# Altium schematic sheet S7CAS-PLEIADES-CARTE-MERE_P07_TITLE.SchDoc
size Tabloid; DocumentNumber: 1; SheetNumber: 1; SheetTotal: 16; Sheet_Name: Title; Size: 11x17
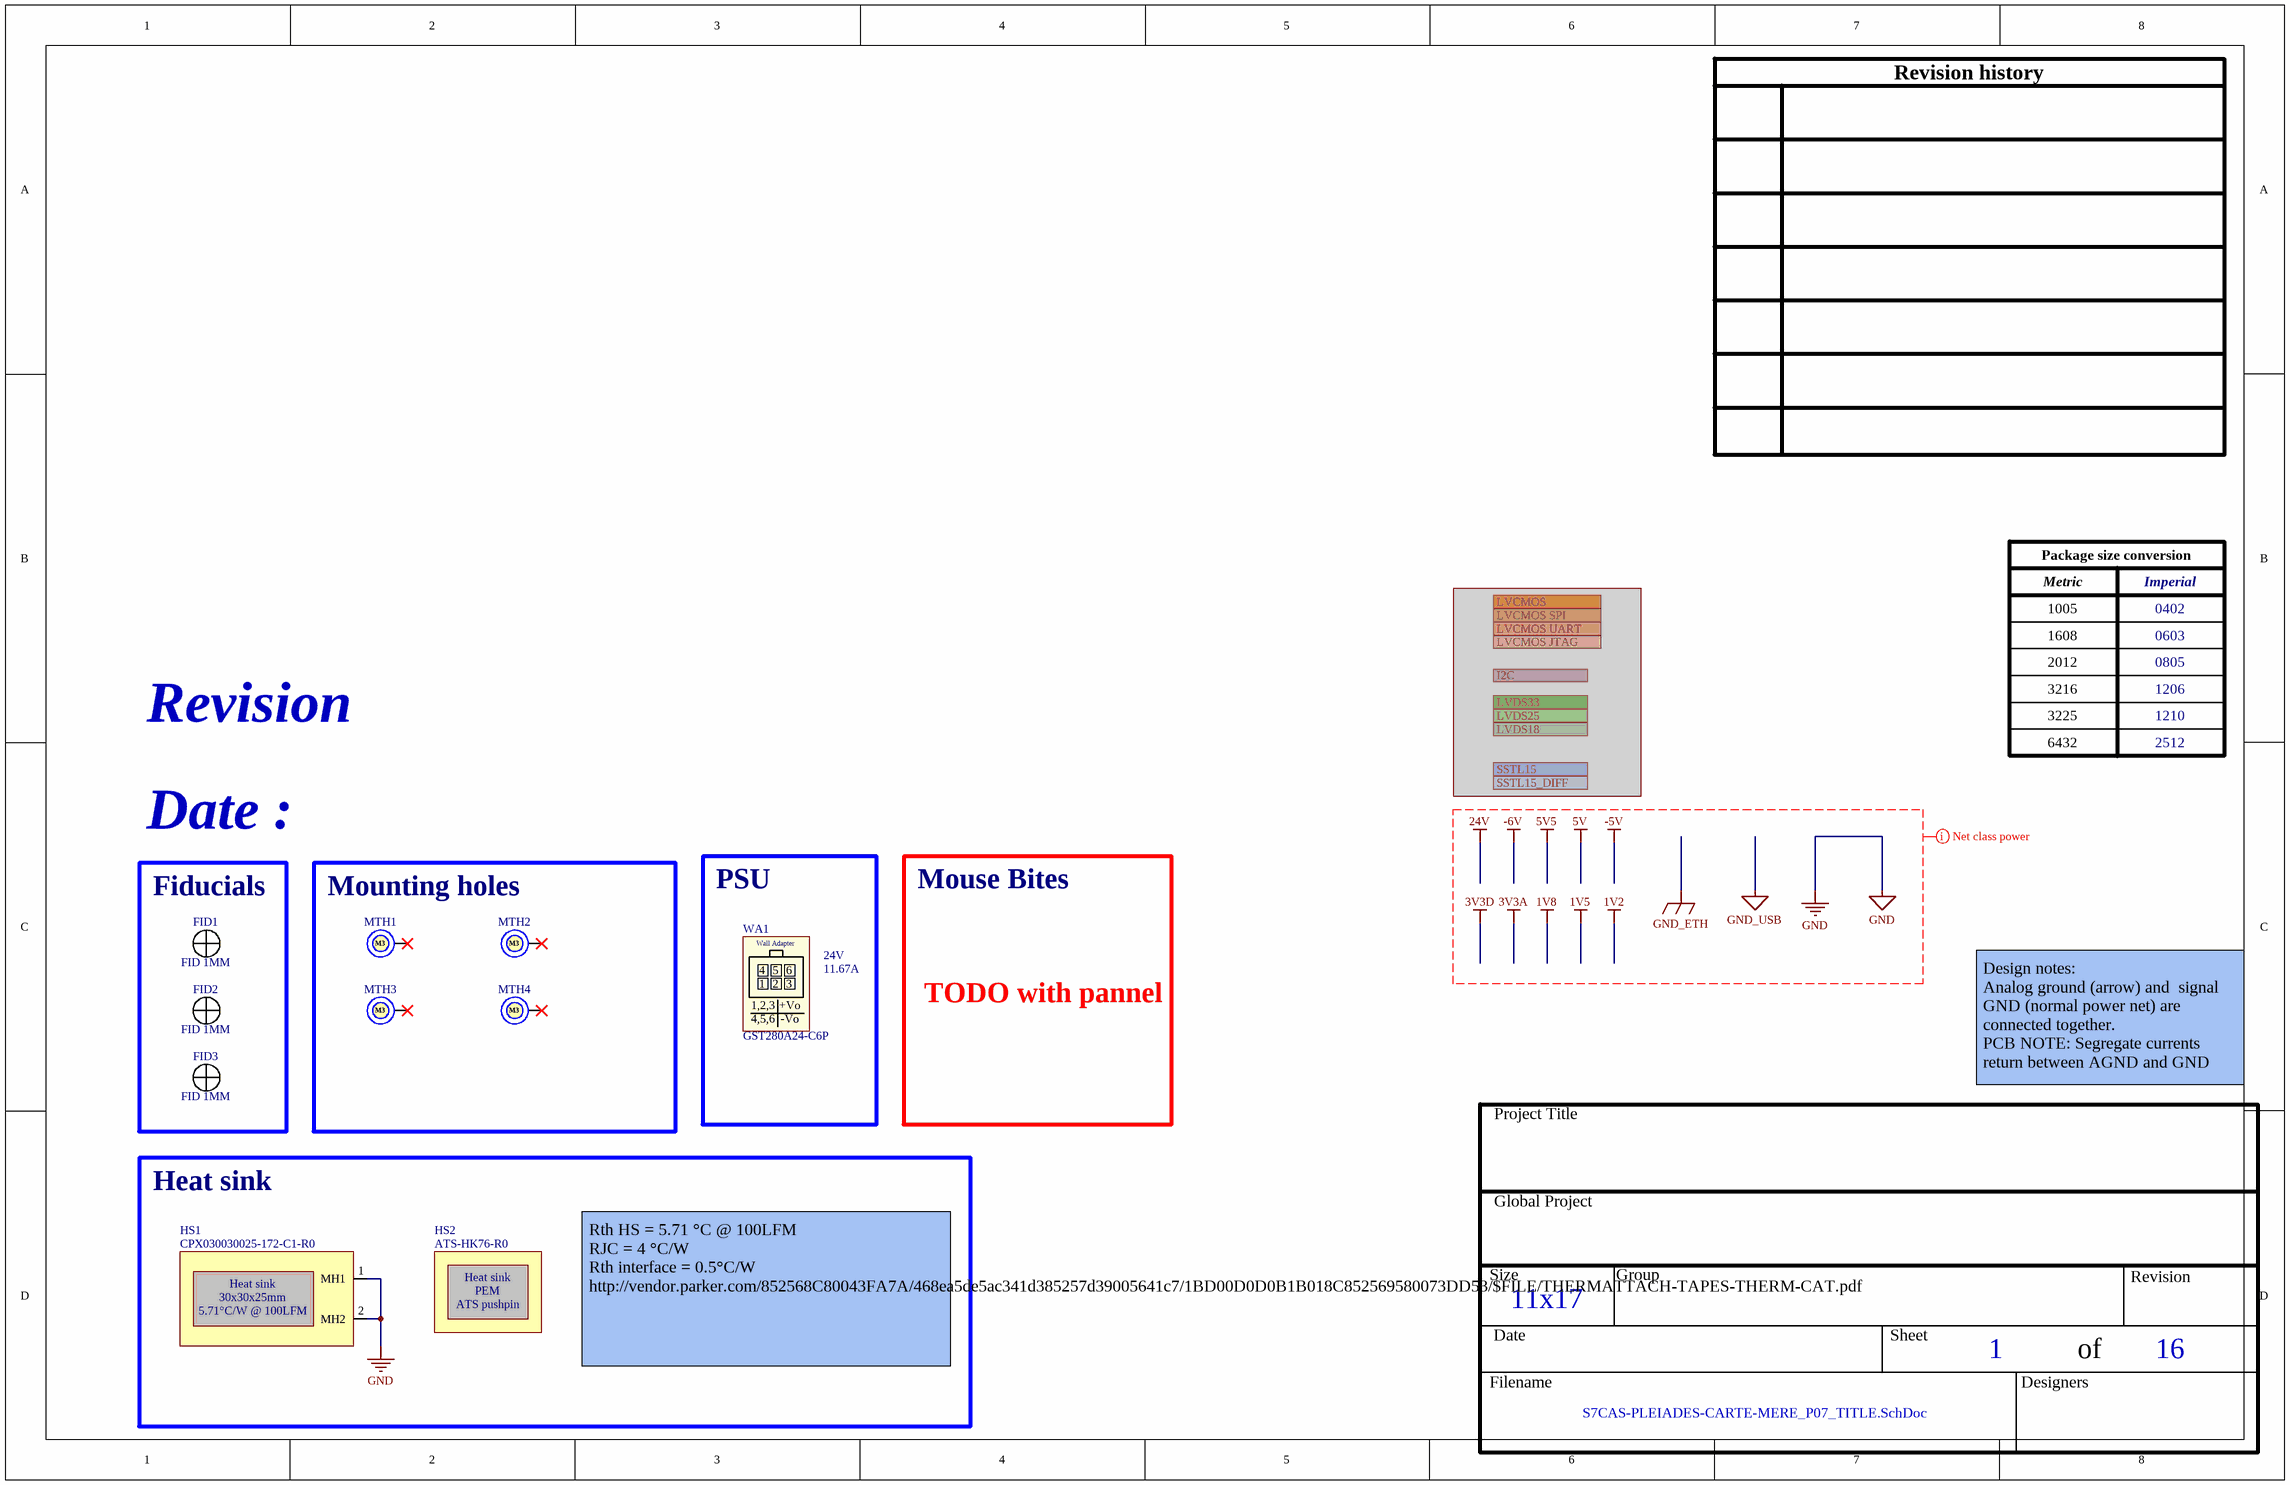
[diagram p0: S7CAS-PLEIADES-CARTE-MERE_P07_TITLE.SchDoc]

## Parts
FID1  FID 1MM  [FID_CIRCLE_1MM]
FID2  FID 1MM  [FID_CIRCLE_1MM]
FID3  FID 1MM  [FID_CIRCLE_1MM]
HS1  CPX030030025-172-C1-R0  [THE_HS_ATS-CPX030030025-172-C1-R0]
HS2  ATS-HK76-R0  [THE_HS_ATS-CPX030030025-172-C1-R0]  (mechanical)
MTH1  M3  [MTH_M3]  (no BOM)
MTH2  M3  [MTH_M3]  (no BOM)
MTH3  M3  [MTH_M3]  (no BOM)
MTH4  M3  [MTH_M3]  (no BOM)
WA1  GST280A24-C6P  value 24V  Current Rating: 11.67A  [Model Name]  (mechanical)

## Blocks framed on the sheet
Fiducials: FID1-FID3
Mounting holes: MTH1-MTH4
PSU: WA1
Heat sink: HS1 HS2

## Ports
I2C, LVCMOS, LVCMOS JTAG, LVCMOS SPI, LVCMOS UART, LVDS18, LVDS25, LVDS33, SSTL15, SSTL15_DIFF

## Nets
GND: HS1.1(MH1) HS1.2(MH2)

Not connected (* = marked no-connect by the designer): FID1 1 2; FID2 1 2; FID3 1 2; MTH1 1*; MTH2 1*; MTH3 1*; MTH4 1*

## Layout directives
net class POWER: 1V2, 1V5, 1V8, 3V3A, 3V3D, 5V, 5V5, 24V, -5V, -6V, GND, GND_ETH, GND_USB

## Notes on the sheet
- Mouse Bites
- TODO with pannel
- Design notes:
  Analog ground (arrow) and  signal GND (normal power net) are connected together.
  PCB NOTE: Segregate currents return between AGND and GND
- Rth HS = 5.71 °C @ 100LFM
  RJC = 4 °C/W
  Rth interface = 0.5°C/W
  http://vendor.parker.com/852568C80043FA7A/468ea5de5ac341d385257d39005641c7/1BD00D0D0B1B018C852569580073DD53/$FILE/THERMATTACH-TAPES-THERM-CAT.pdf
- Revision history
- Package size conversion
- Metric
- 1005
- 1608
- Imperial
- 0402
- 0603
- Revision
- 2012
- 3216
- 0805
- 1206
- 3225
- 6432
- 1210
- 2512
- Date :
- Project Title
- Global Project
- Size
- Group
- Date
- Sheet
- of
- Filename
- Designers
- (in symbol MEC_ATS-HK76-R0) Heat sink; PEM; ATS pushpin
- (in symbol THE_HS_ATS-CPX030030025-172-C1-R0) Heat sink; 30x30x25mm; 5.71°C/W @ 100LFM
- (in symbol UND_GST280A24-C6P) Wall Adapter; 4; 5; 6; 1; 2; 3; 1,2,3; +Vo; 4,5,6; -Vo

## Library data of the parts
FID1-FID3 = FID_CIRCLE_1MM: FID - FIDUCIAL 1MM CIRCLE DOUBLE-SIDED - 1MM; GRAMS Lib Spec: 2.8; Magnetic Material: NO; Cryo: UNKNOWN; Value: *; Tolerance: *; Voltage Rating: *; Current Rating: *; Power Max: *; HelpURL: https://www.pcb-3d.com/wordpress/wp-content/uploads/ipc-sm-782a_amendment_1_and_2.pdf; CreatedBy/Date: Jonathan Bouchard 2018-07-23; VerifiedBy: Caroline Paulin - 25 juillet 2018; Temperature: *; Package: 1MM CIRCLE; Manufacturer #1: *; Manufacturer #2: *; Note: *; Assembly Type: NONE; Part Number #2: *; Part Number #1: *; Polarized: *; Supplier 1: *; Supplier Part Number 1: *
HS1 = THE_HS_ATS-CPX030030025-172-C1-R0: THE_HS - Heat Sink 30x30x25 mm - TH; Power Max: 5.71 °C/W @ 100LFM; HelpURL: https://www.digikey.ca/en/products/detail/advanced-thermal-solutions-inc/ATS-CPX030030025-172-C1-R0/4753835; Part Number #1: CPX030030025-172-C1-R0; Supplier 1: Digi-Key; Supplier Part Number 1: ATS35935-ND
HS2 = MEC_ATS-HK76-R0: MEC - Heat Sink PEM - TH; Power Max: 5.71 °C/W @ 100LFM; HelpURL: https://www.digikey.ca/en/products/detail/advanced-thermal-solutions-inc/ATS-HK76-R0/4809541; Part Number #1: ATS-HK76-R0; Supplier 1: Digi-Key; Supplier Part Number 1: ATS1911-ND
MTH1-MTH4 = MTH_M3: MTH - MOUNTING HOLE M3 PLATED - M3; GRAMS Lib Spec: 2.8; Magnetic Material: NO; Cryo: UNKNOWN; Value: *; Tolerance: *; Voltage Rating: *; Current Rating: *; Power Max: *; HelpURL: https://littlemachineshop.com/images/gallery/PDF/TapDrillSizes.pdf; CreatedBy/Date: Jonathan Bouchard 2018-07-23; VerifiedBy: Arnaud Samson 23-07-18; Temperature: *; Package: M3; Manufacturer #1: *; Manufacturer #2: *; Note: *; Assembly Type: NONE; Part Number #2: *; Part Number #1: *; Polarized: *; Supplier 1: *; Supplier Part Number 1: *
WA1 = UND_GST280A24-C6P: UND - AC/DC DESKTOP ADAPTER 24V 280W - MEC; Manufacturer #1: MEAN WELL USA Inc.; Tolerance: ±3%; Voltage Rating: 85~264VAC; GRAMS Lib Spec: 2.8; Magnetic Material: Unknown; Polarized: Yes; Power Max: 280W; HelpURL: https://www.meanwell.com/Upload/PDF/GST280A/GST280A-SPEC.PDF; CreatedBy/Date: Caroline Paulin - 5 avril 2019; VerifiedBy: Nicolas V. (2019-07-05); Temperature: -30°C to +70°C; Package: -; Manufacturer #2: *; Note: *; Assembly Type: -; Part Number #2: *; Part Number #1: GST280A24-C6P; Supplier 1: Digi-Key; Supplier Part Number 1: 1866-2122-ND; Cryo: UNKNOWN